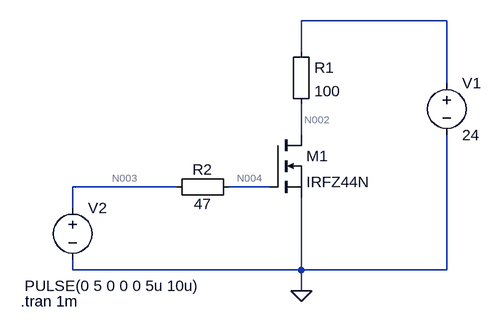
[diagram p0: schematic Drive1.asc]
Drive1.asc, the LTspice schematic file:
Version 4
SHEET 1 880 680
WIRE 320 -96 96 -96
WIRE 96 -48 96 -96
WIRE 320 0 320 -96
WIRE 96 80 96 32
WIRE -96 160 -256 160
WIRE 48 160 -16 160
WIRE -256 192 -256 160
WIRE -256 288 -256 272
WIRE 96 288 96 176
WIRE 96 288 -256 288
WIRE 320 288 320 80
WIRE 320 288 96 288
WIRE 96 320 96 288
FLAG 96 320 0
SYMBOL nmos 48 80 R0
SYMATTR InstName M1
SYMATTR Value IRFZ44N
SYMBOL voltage 320 -16 R0
WINDOW 123 0 0 Left 0
WINDOW 39 0 0 Left 0
SYMATTR InstName V1
SYMATTR Value 24
SYMBOL Misc\\EuropeanResistor 80 -64 R0
SYMATTR InstName R1
SYMATTR Value 100
SYMBOL Misc\\EuropeanResistor -112 176 R270
WINDOW 0 27 56 VTop 2
WINDOW 3 5 56 VBottom 2
SYMATTR InstName R2
SYMATTR Value 47
SYMBOL voltage -256 176 R0
WINDOW 3 -74 136 Left 2
WINDOW 123 0 0 Left 0
WINDOW 39 0 0 Left 0
SYMATTR Value PULSE(0 5 0 0 0 5u 10u)
SYMATTR InstName V2
TEXT -336 336 Left 2 !.tran 1m

The netlist it stands for:
* Drive1.asc
M1 N002 N004 0 0 IRFZ44N
V1 N001 0 24
R1 N001 N002 100
R2 N003 N004 47
V2 N003 0 PULSE(0 5 0 0 0 5u 10u)
.model NMOS NMOS
.model PMOS PMOS
.lib standard.mos
.tran 1m
.backanno
.end

* Results of the author's LTspice run, read from the files saved beside the schematic
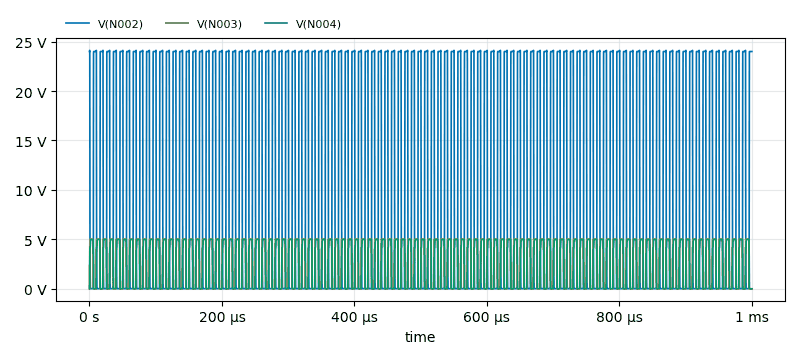
[diagram p1: Transient Analysis of Drive1.asc, plotted from the saved traces]
* Transient Analysis, 1 run:
*   V(N002): min 13.86 mV, max 24.12 V, average 11.3 V, rms 16.25 V, last 24 V
*   V(N003): min 0 V, max 5 V, average 2.75 V, rms 3.652 V, last 0 V
*   V(N004): min 0 V, max 5 V, average 2.75 V, rms 3.607 V, last 0 V